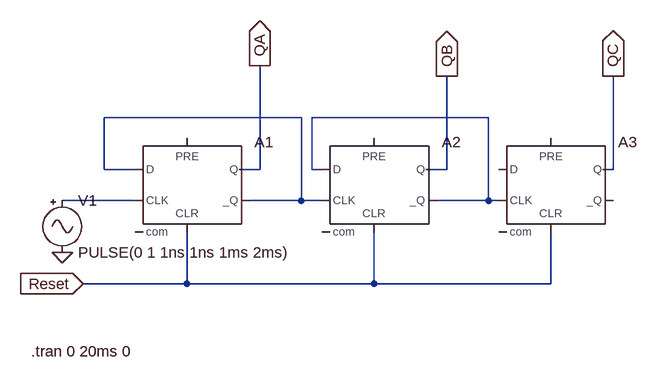
[diagram p0: schematic tentativa flipflop.asc]
tentativa flipflop.asc, the LTspice schematic file:
Version 4
SHEET 1 880 680
WIRE 272 48 -32 48
WIRE 560 48 288 48
WIRE -32 128 -32 48
WIRE 16 128 -32 128
WIRE 208 128 208 -32
WIRE 208 128 176 128
WIRE 288 128 288 48
WIRE 304 128 288 128
WIRE 496 128 496 -16
WIRE 496 128 464 128
WIRE 752 128 752 -16
WIRE 752 128 736 128
WIRE 16 176 -96 176
WIRE 272 176 272 48
WIRE 272 176 192 176
WIRE 304 176 272 176
WIRE 560 176 560 48
WIRE 560 176 480 176
WIRE 576 176 560 176
WIRE 96 304 96 224
WIRE 96 304 -64 304
WIRE 384 304 384 224
WIRE 384 304 96 304
WIRE 656 304 656 224
WIRE 656 304 384 304
FLAG 208 -32 QA
IOPIN 208 -32 Out
FLAG 496 -16 QB
IOPIN 496 -16 Out
FLAG 752 -16 QC
IOPIN 752 -16 Out
FLAG -96 256 0
FLAG -64 304 Reset
IOPIN -64 304 In
SYMBOL Digital\\dflop 96 80 R0
SYMATTR InstName A1
SYMBOL Digital\\dflop 384 80 R0
SYMATTR InstName A2
SYMBOL Digital\\dflop 656 80 R0
SYMATTR InstName A3
SYMBOL Misc\\signal -96 160 R0
WINDOW 123 0 0 Left 0
WINDOW 39 0 0 Left 0
SYMATTR InstName V1
SYMATTR Value PULSE(0 1 1ns 1ns 1ms 2ms)
TEXT -144 408 Left 2 !.tran 0 20ms 0

The netlist it stands for:
* tentativa flipflop.asc
A1 N001 0 N003 0 Reset N001 QA 0 DFLOP
A2 N002 0 N001 0 Reset N002 QB 0 DFLOP
A3 0 0 N002 0 Reset 0 QC 0 DFLOP
V1 N003 0 PULSE(0 1 1ns 1ns 1ms 2ms)
.tran 0 20ms 0
.backanno
.end